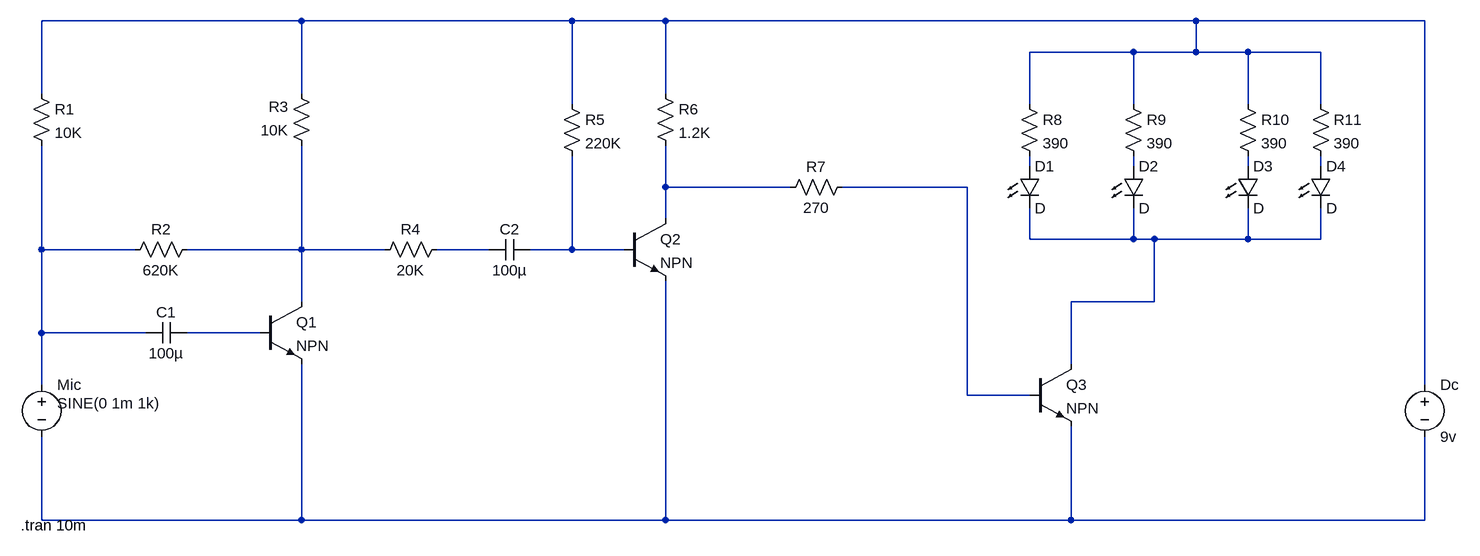
[diagram p0: schematic projectpart1-2.asc]
projectpart1-2.asc, the LTspice schematic file:
Version 4
SHEET 1 2216 680
WIRE 432 -400 32 -400
WIRE 848 -400 432 -400
WIRE 992 -400 848 -400
WIRE 1808 -400 992 -400
WIRE 2160 -400 1808 -400
WIRE 1712 -352 1552 -352
WIRE 1808 -352 1808 -400
WIRE 1808 -352 1712 -352
WIRE 1888 -352 1808 -352
WIRE 2000 -352 1888 -352
WIRE 32 -288 32 -400
WIRE 432 -288 432 -400
WIRE 992 -288 992 -400
WIRE 848 -272 848 -400
WIRE 1552 -272 1552 -352
WIRE 1712 -272 1712 -352
WIRE 1888 -272 1888 -352
WIRE 2000 -272 2000 -352
WIRE 1552 -176 1552 -192
WIRE 1712 -176 1712 -192
WIRE 1888 -176 1888 -192
WIRE 2000 -176 2000 -192
WIRE 992 -144 992 -208
WIRE 1184 -144 992 -144
WIRE 1456 -144 1264 -144
WIRE 992 -96 992 -144
WIRE 1552 -64 1552 -112
WIRE 1712 -64 1712 -112
WIRE 1712 -64 1552 -64
WIRE 1744 -64 1712 -64
WIRE 1888 -64 1888 -112
WIRE 1888 -64 1744 -64
WIRE 2000 -64 2000 -112
WIRE 2000 -64 1888 -64
WIRE 32 -48 32 -208
WIRE 176 -48 32 -48
WIRE 432 -48 432 -208
WIRE 432 -48 256 -48
WIRE 560 -48 432 -48
WIRE 720 -48 640 -48
WIRE 848 -48 848 -192
WIRE 848 -48 784 -48
WIRE 928 -48 848 -48
WIRE 432 32 432 -48
WIRE 1744 32 1744 -64
WIRE 1744 32 1616 32
WIRE 32 80 32 -48
WIRE 192 80 32 80
WIRE 368 80 256 80
WIRE 1616 128 1616 32
WIRE 32 160 32 80
WIRE 2160 160 2160 -400
WIRE 1456 176 1456 -144
WIRE 1552 176 1456 176
WIRE 32 368 32 240
WIRE 432 368 432 128
WIRE 432 368 32 368
WIRE 992 368 992 0
WIRE 992 368 432 368
WIRE 1616 368 1616 224
WIRE 1616 368 992 368
WIRE 2160 368 2160 240
WIRE 2160 368 1616 368
SYMBOL voltage 32 144 R0
WINDOW 123 24 124 Left 2
WINDOW 39 0 0 Left 0
WINDOW 3 24 44 Left 2
SYMATTR InstName Mic
SYMATTR Value SINE(0 1m 1k)
SYMBOL res 16 -304 R0
SYMATTR InstName R1
SYMATTR Value 10K
SYMBOL res 272 -64 R90
WINDOW 0 0 56 VBottom 2
WINDOW 3 32 56 VTop 2
SYMATTR InstName R2
SYMATTR Value 620K
SYMBOL res 448 -192 R180
WINDOW 0 36 76 Left 2
WINDOW 3 36 40 Left 2
SYMATTR InstName R3
SYMATTR Value 10K
SYMBOL res 544 -32 R270
WINDOW 0 32 56 VTop 2
WINDOW 3 0 56 VBottom 2
SYMATTR InstName R4
SYMATTR Value 20K
SYMBOL res 832 -288 R0
SYMATTR InstName R5
SYMATTR Value 220K
SYMBOL cap 256 64 R90
WINDOW 0 0 32 VBottom 2
WINDOW 3 32 32 VTop 2
SYMATTR InstName C1
SYMATTR Value 100µ
SYMBOL cap 784 -64 R90
WINDOW 0 0 32 VBottom 2
WINDOW 3 32 32 VTop 2
SYMATTR InstName C2
SYMATTR Value 100µ
SYMBOL res 976 -304 R0
SYMATTR InstName R6
SYMATTR Value 1.2K
SYMBOL res 1280 -160 R90
WINDOW 0 0 56 VBottom 2
WINDOW 3 32 56 VTop 2
SYMATTR InstName R7
SYMATTR Value 270
SYMBOL res 1536 -288 R0
SYMATTR InstName R8
SYMATTR Value 390
SYMBOL res 1696 -288 R0
SYMATTR InstName R9
SYMATTR Value 390
SYMBOL res 1872 -288 R0
SYMATTR InstName R10
SYMATTR Value 390
SYMBOL res 1984 -288 R0
SYMATTR InstName R11
SYMATTR Value 390
SYMBOL voltage 2160 144 R0
WINDOW 123 0 0 Left 0
WINDOW 39 0 0 Left 0
SYMATTR InstName Dc
SYMATTR Value 9v
SYMBOL LED 1536 -176 R0
SYMATTR InstName D1
SYMBOL LED 1696 -176 R0
SYMATTR InstName D2
SYMBOL LED 1872 -176 R0
SYMATTR InstName D3
SYMBOL LED 1984 -176 R0
SYMATTR InstName D4
SYMBOL npn 368 32 R0
SYMATTR InstName Q1
SYMBOL npn 928 -96 R0
SYMATTR InstName Q2
SYMBOL npn 1552 128 R0
SYMATTR InstName Q3
TEXT 0 376 Left 2 !.tran 10m

The netlist it stands for:
* projectpart1-2.asc
V§Mic N009 N014 SINE(0 1m 1k)
R1 N001 N009 10K
R2 N010 N009 620K
R3 N010 N001 10K
R4 N010 N011 20K
R5 N001 N012 220K
C1 N013 N009 100µ
C2 N012 N011 100µ
R6 N001 N006 1.2K
R7 N007 N006 270
R8 N001 N002 390
R9 N001 N003 390
R10 N001 N004 390
R11 N001 N005 390
V§Dc N001 N014 9v
D1 N002 N008 D
D2 N003 N008 D
D3 N004 N008 D
D4 N005 N008 D
Q1 N010 N013 N014 0 NPN
Q2 N006 N012 N014 0 NPN
Q3 N008 N007 N014 0 NPN
.model D D
.lib standard.dio
.model NPN NPN
.model PNP PNP
.lib standard.bjt
.tran 10m
.backanno
.end